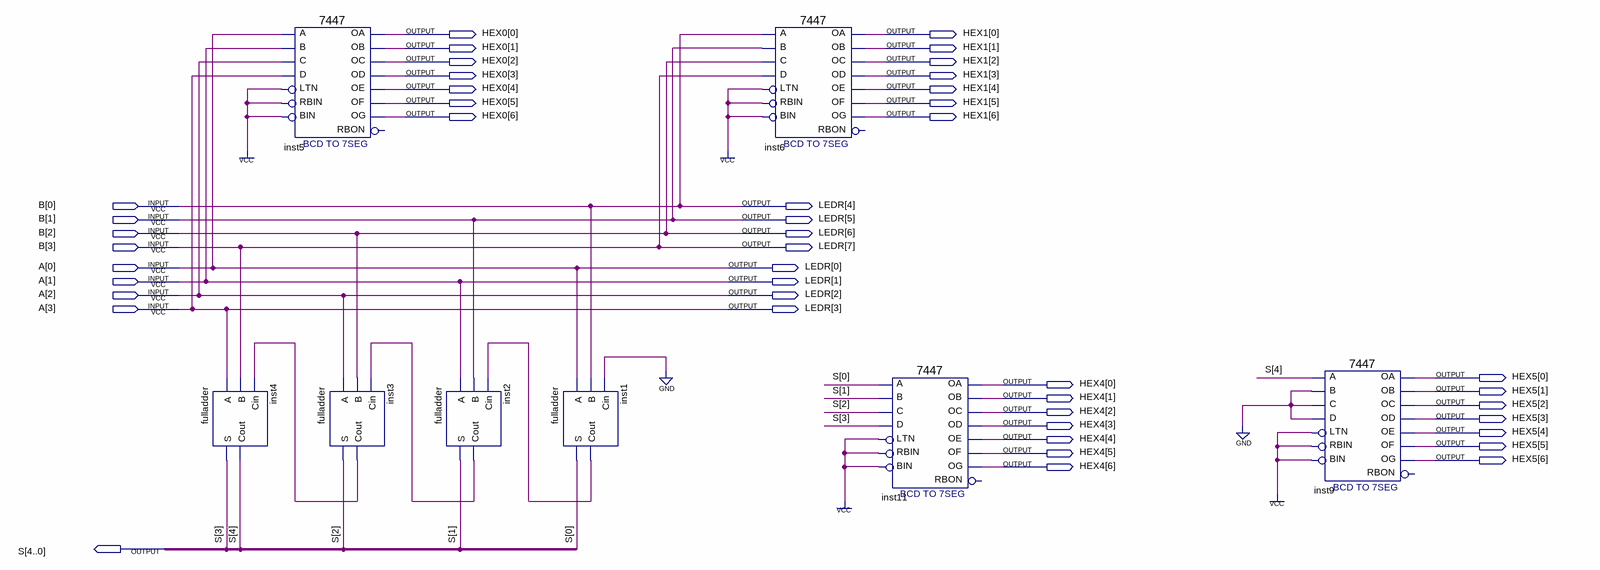
[diagram p0: schematic sheet]
// Quartus schematic FA4bits_with_7Seg.bdf as structural Verilog: 8 symbols, 45 pins
module FA4bits_with_7Seg (
  input  [3:0] B,
  input  [3:0] A,
  output [6:0] HEX0,
  output [6:0] HEX1,
  output [7:0] LEDR,
  output [6:0] HEX5,
  output [6:0] HEX4,
  output [4:0] S
);

  wire inst1_cout, inst2_cout, inst3_cout;

  fulladder inst4 (.A(A[3]), .B(B[3]), .Cin(inst3_cout), .Cout(S[4]), .S(S[3]));
  \7447  inst5 (
    .LTN(1'b1), .B(A[1]), .C(A[2]), .D(A[3]), .RBIN(1'b1), .BIN(1'b1), .A(A[0]), .OB(HEX0[1]), .OC(HEX0[2]),
    .OE(HEX0[4]), .OD(HEX0[3]), .OF(HEX0[5]), .OG(HEX0[6]), .OA(HEX0[0]));  // open: RBON
  fulladder inst3 (.A(A[2]), .B(B[2]), .Cin(inst2_cout), .Cout(inst3_cout), .S(S[2]));
  fulladder inst2 (.A(A[1]), .B(B[1]), .Cin(inst1_cout), .Cout(inst2_cout), .S(S[1]));
  fulladder inst1 (.A(A[0]), .B(B[0]), .Cin(1'b0), .Cout(inst1_cout), .S(S[0]));
  \7447  inst6 (
    .LTN(1'b1), .B(B[1]), .C(B[2]), .D(B[3]), .RBIN(1'b1), .BIN(1'b1), .A(B[0]), .OB(HEX1[1]), .OC(HEX1[2]),
    .OE(HEX1[4]), .OD(HEX1[3]), .OF(HEX1[5]), .OG(HEX1[6]), .OA(HEX1[0]));  // open: RBON
  \7447  inst11 (
    .LTN(1'b1), .B(S[1]), .C(S[2]), .D(S[3]), .RBIN(1'b1), .BIN(1'b1), .A(S[0]), .OB(HEX4[1]), .OC(HEX4[2]),
    .OE(HEX4[4]), .OD(HEX4[3]), .OF(HEX4[5]), .OG(HEX4[6]), .OA(HEX4[0]));  // open: RBON
  \7447  inst9 (
    .LTN(1'b1), .B(1'b0), .C(1'b0), .D(1'b0), .RBIN(1'b1), .BIN(1'b1), .A(S[4]), .OB(HEX5[1]), .OC(HEX5[2]),
    .OE(HEX5[4]), .OD(HEX5[3]), .OF(HEX5[5]), .OG(HEX5[6]), .OA(HEX5[0]));  // open: RBON

  assign LEDR = {B, A};
endmodule
